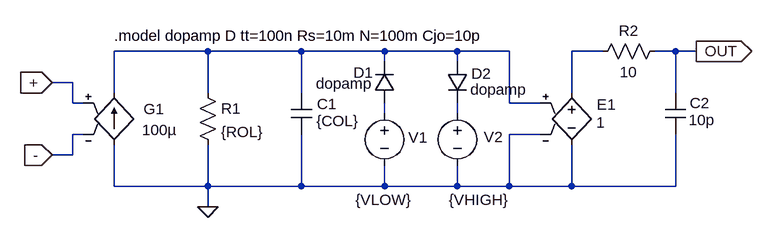
[diagram p0: schematic opampTOF.asc]
opampTOF.asc, the LTspice schematic file:
Version 4
SHEET 1 1164 680
WIRE 304 128 160 128
WIRE 448 128 304 128
WIRE 576 128 448 128
WIRE 688 128 576 128
WIRE 768 128 688 128
WIRE 912 128 864 128
WIRE 1024 128 992 128
WIRE 1056 128 1024 128
WIRE 576 144 576 128
WIRE 688 144 688 128
WIRE 96 176 64 176
WIRE 160 192 160 128
WIRE 304 192 304 128
WIRE 448 192 448 128
WIRE 864 192 864 128
WIRE 1024 192 1024 128
WIRE 96 208 96 176
WIRE 112 208 96 208
WIRE 768 208 768 128
WIRE 816 208 768 208
WIRE 576 224 576 208
WIRE 688 224 688 208
WIRE 112 256 96 256
WIRE 816 256 768 256
WIRE 96 288 96 256
WIRE 96 288 64 288
WIRE 160 336 160 272
WIRE 304 336 304 272
WIRE 304 336 160 336
WIRE 448 336 448 256
WIRE 448 336 304 336
WIRE 576 336 576 304
WIRE 576 336 448 336
WIRE 688 336 688 304
WIRE 688 336 576 336
WIRE 768 336 768 256
WIRE 768 336 688 336
WIRE 864 336 864 272
WIRE 864 336 768 336
WIRE 1024 336 1024 256
WIRE 1024 336 864 336
WIRE 304 368 304 336
FLAG 304 368 0
FLAG 64 176 +
IOPIN 64 176 In
FLAG 64 288 -
IOPIN 64 288 In
FLAG 1056 128 OUT
IOPIN 1056 128 Out
SYMBOL g 160 176 R0
WINDOW 0 45 41 Left 2
WINDOW 3 43 73 Left 2
SYMATTR InstName G1
SYMATTR Value 100µ
SYMBOL res 288 176 R0
SYMATTR InstName R1
SYMATTR Value {ROL}
SYMBOL cap 432 192 R0
WINDOW 0 40 17 Left 2
WINDOW 3 39 43 Left 2
SYMATTR InstName C1
SYMATTR Value {COL}
SYMBOL diode 592 208 R180
WINDOW 0 33 47 Left 2
WINDOW 3 34 30 Left 2
SYMATTR InstName D1
SYMATTR Value dopamp
SYMBOL diode 672 144 R0
WINDOW 0 38 18 Left 2
WINDOW 3 36 43 Left 2
SYMATTR InstName D2
SYMATTR Value dopamp
SYMBOL voltage 576 208 R0
WINDOW 0 37 53 Left 2
WINDOW 3 -45 149 Left 2
WINDOW 123 0 0 Left 0
WINDOW 39 0 0 Left 0
SYMATTR InstName V1
SYMATTR Value {VLOW}
SYMBOL voltage 688 208 R0
WINDOW 0 41 52 Left 2
WINDOW 3 -13 149 Left 2
SYMATTR InstName V2
SYMATTR Value {VHIGH}
SYMBOL e 864 176 R0
WINDOW 0 39 34 Left 2
WINDOW 3 38 62 Left 2
SYMATTR InstName E1
SYMATTR Value 1
SYMBOL res 1008 112 R90
WINDOW 0 0 56 VBottom 2
WINDOW 3 32 56 VTop 2
SYMATTR InstName R2
SYMATTR Value 10
SYMBOL cap 1008 192 R0
WINDOW 0 38 16 Left 2
WINDOW 3 36 42 Left 2
SYMATTR InstName C2
SYMATTR Value 10p
TEXT 160 104 Left 2 !.model dopamp D tt=100n Rs=10m N=100m Cjo=10p

The netlist it stands for:
* opampTOF.asc
G1 0 N001 + - 100µ
R1 N001 0 {ROL}
C1 N001 0 {COL}
D1 N003 N001 dopamp
D2 N001 N004 dopamp
V1 N003 0 {VLOW}
V2 N004 0 {VHIGH}
E1 N002 0 N001 0 1
R2 OUT N002 10
C2 OUT 0 10p
.model D D
.lib standard.dio
.model dopamp D tt=100n Rs=10m N=100m Cjo=10p
.backanno
.end